# EasyEDA schematic SCH_sigmapad_2025-06-06.json
TITLE: Sheet_1; REV: 1.0; Date: 2025-06-02; Sheet: 1/1; Drawn By: saymonislam924; Company: Your Company
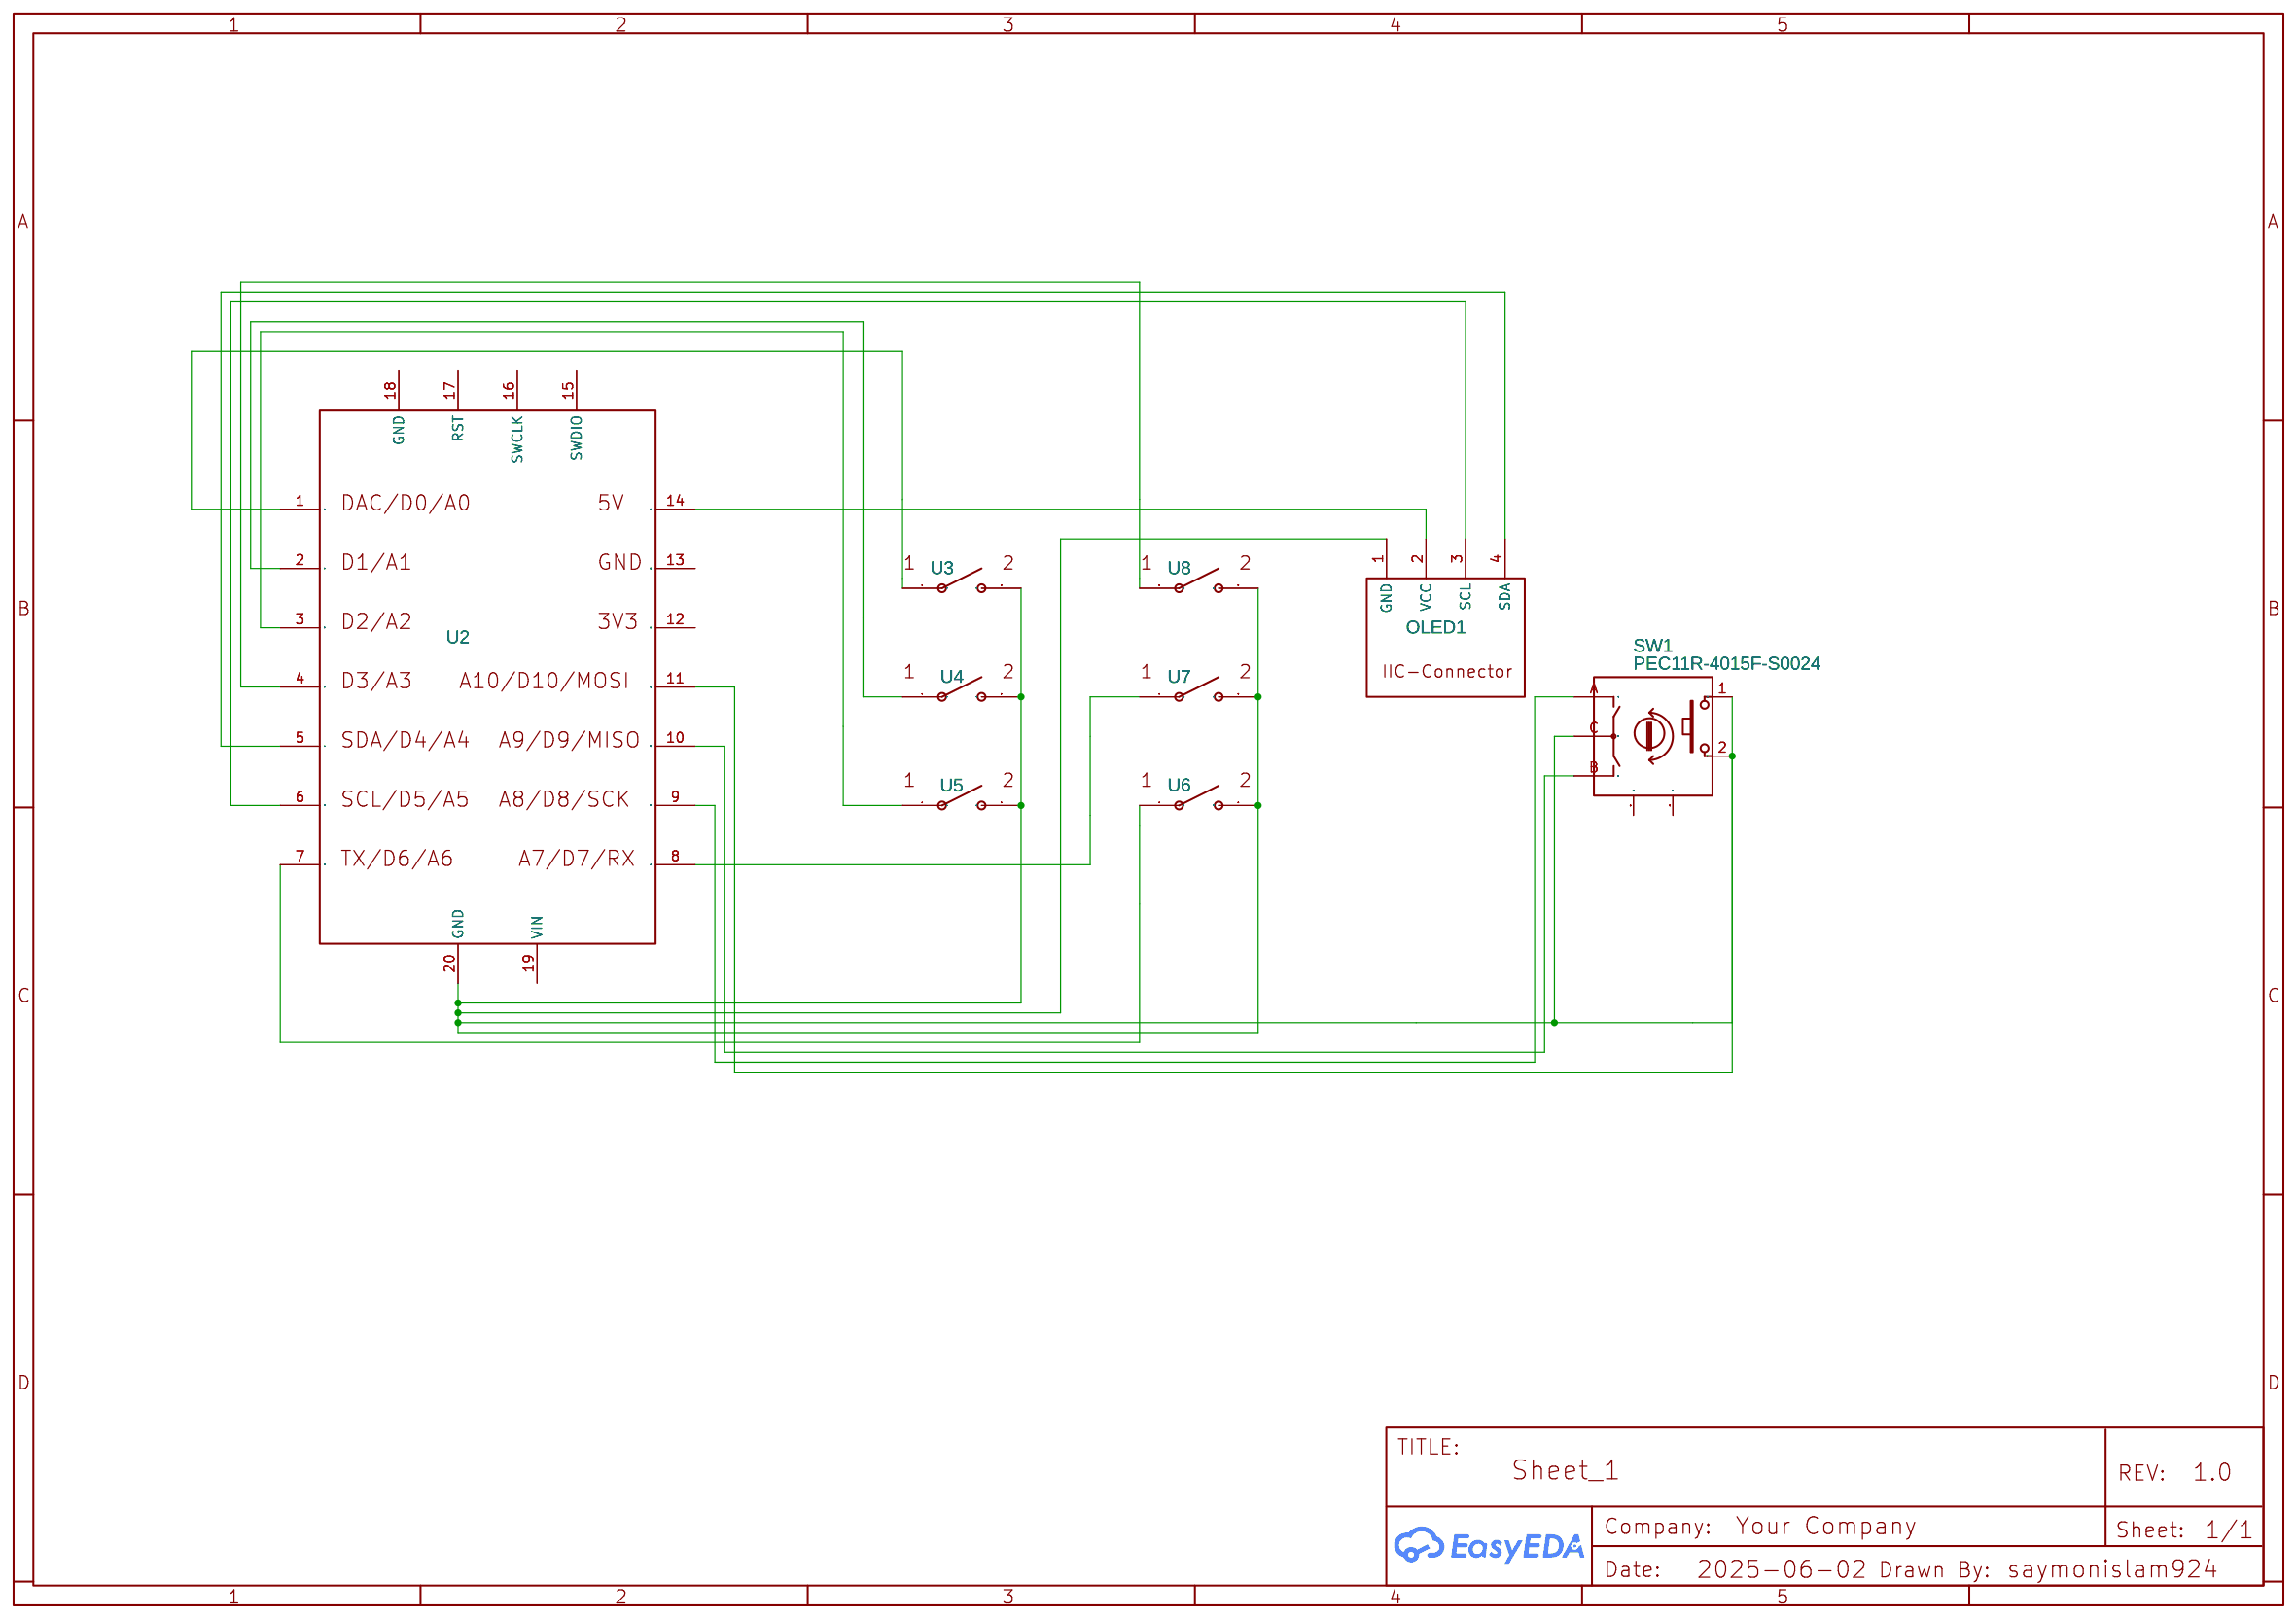
[diagram p0: schematic sheet]

## Parts
OLED1  0.96OLED_4P_MODULE_JX  [0.96OLED_4P]
SW1  PEC11R-4015F-S0024  [SW-TH_PEC11R-4XXXF-SXXXX]
U2  Seeed XIAO RP2040 ALL PINS  [SEEED XIAO RP2040]
U3  CHERRY MX MECHANICAL KEYBOARD SWITCH COPY  [CHERRY MX KEYSWITCH]
U4  CHERRY MX MECHANICAL KEYBOARD SWITCH COPY  [CHERRY MX KEYSWITCH]
U5  CHERRY MX MECHANICAL KEYBOARD SWITCH COPY  [CHERRY MX KEYSWITCH]
U6  CHERRY MX MECHANICAL KEYBOARD SWITCH COPY  [CHERRY MX KEYSWITCH]
U7  CHERRY MX MECHANICAL KEYBOARD SWITCH COPY  [CHERRY MX KEYSWITCH]
U8  CHERRY MX MECHANICAL KEYBOARD SWITCH COPY  [CHERRY MX KEYSWITCH]

## Library data of the parts
OLED1 = 0.96OLED_4P_MODULE_JX: Contributor: LCSC; Supplier: LCSC; Supplier Part: C9900004566; Manufacturer: null; JLCPCB Part Class: Extended Part
SW1 = PEC11R-4015F-S0024: Contributor: LCSC; Supplier: LCSC; Supplier Part: C143789; Manufacturer: BOURNS; JLCPCB Part Class: Extended Part
U2 = Seeed XIAO RP2040 ALL PINS: Manufacturer: Seeedstudio; Manufacturer Part: 102010328; link: https://www.seeedstudio.com/Seeeduino-XIAO-Arduino-Microcontroller-SAMD21-Cortex-M0+-p-4426.html; Contributor: mkyo2001
U3-U8 = CHERRY MX MECHANICAL KEYBOARD SWITCH COPY: Contributor: clay53

## Nets
Net-(OLED1-1): OLED1.1(GND) SW1.1 SW1.2 SW1.C U2.11(10) U2.20(GND) U3.2 U4.2 U5.2 U6.2 U7.2 U8.2
Net-(OLED1-2): OLED1.2(VCC) U2.14(13)
Net-(OLED1-3): OLED1.3(SCL) U2.6(5)
Net-(OLED1-4): OLED1.4(SDA) U2.5(4)
Net-(SW1-A): SW1.A U2.9(8)
Net-(SW1-B): SW1.B U2.10(9)
Net-(U2-1): U2.1(0) U3.1
Net-(U2-2): U2.2(1) U4.1
Net-(U2-3): U2.3(2) U5.1
Net-(U2-4): U2.4(3) U8.1
Net-(U2-7): U2.7(6) U6.1
Net-(U2-8): U2.8(7) U7.1

Not connected (* = marked no-connect by the designer): SW1 MT1 MT2; U2 12(11) 13(12) 15(SWDIO) 16(SWCLK) 17(RST) 18(GND) 19(VIN)
